# Altium schematic sheet tb6612fng.SchDoc
size A4
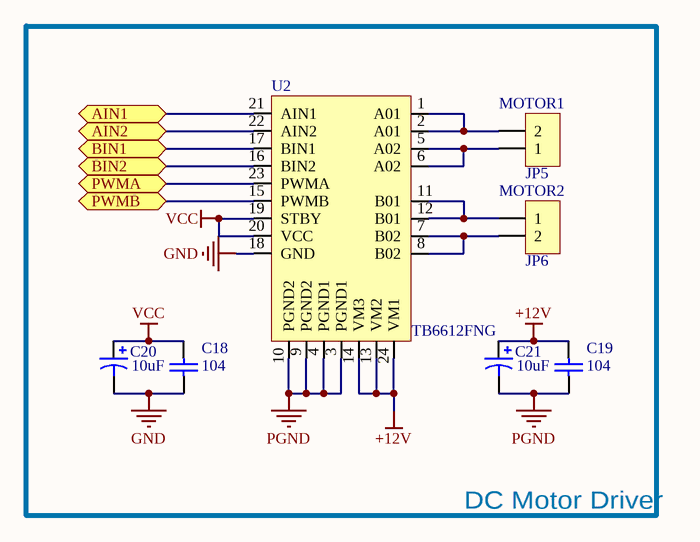
[diagram p0: tb6612fng.SchDoc]

## Parts
C18  104  [C 0603_L]
C19  104  [C 0603_L]
C20  10uF  [CD A(3216)]
C21  10uF  [CD A(3216)]
JP5  MOTOR1  [XH2.54-LI-2P]
JP6  MOTOR2  [XH2.54-LI-2P]
U2  TB6612FNG  [SSOP24_N]

## Blocks framed on the sheet
DC Motor Driver: C18-C21 JP5 JP6 U2

## Ports
AIN1 (bidir), AIN2 (bidir), BIN1 (bidir), BIN2 (bidir), PWMA (bidir), PWMB (bidir)

## Nets
+12V: C19.2 C21.1 U2.13(VM2) U2.14(VM3) U2.24(VM1)
GND: C18.1 C20.2 U2.18(GND)
PGND: C19.1 C21.2 U2.3(PGND1) U2.4(PGND1) U2.9(PGND2) U2.10(PGND2)
VCC: C18.2 C20.1 U2.19(STBY) U2.20(VCC)
AIN1: U2.21(AIN1) ; port AIN1
AIN2: U2.22(AIN2) ; port AIN2
BIN1: U2.17(BIN1) ; port BIN1
BIN2: U2.16(BIN2) ; port BIN2
PWMA: U2.23(PWMA) ; port PWMA
PWMB: U2.15(PWMB) ; port PWMB
NetJP5_1: JP5.1 U2.5(A02) U2.6(A02)
NetJP5_2: JP5.2 U2.1(A01) U2.2(A01)
NetJP6_1: JP6.1 U2.11(B01) U2.12(B01)
NetJP6_2: JP6.2 U2.7(B02) U2.8(B02)

## Library data of the parts
C18 C19 = Cap: Capacitor; Published: 8-Jun-2000; LatestRevisionDate: 17-Jul-2002; LatestRevisionNote: Re-released for DXP Platform.; PackageReference: RAD-0.3; Publisher: Altium Limited; PackageDescription: Radial Cap, Thru-Hole; 2 Leads; 0.3 in Pin Spacing; Value: 104
C20 C21 = Cap Pol1: Polarized Capacitor (Radial); Published: 8-Jun-2000; LatestRevisionDate: 17-Jul-2002; LatestRevisionNote: Re-released for DXP Platform.; PackageReference: RB7.6-15; Publisher: Altium Limited; PackageDescription: Polarized Capacitor (Radial); 2 Leads; Value: 10uF
JP5 JP6 = Header 2: 2P接插件; 版权归属: 源创客; BOM名称: 2P接插件; 学习资源: www.ooocke.com
U2 = TB6612FNG: DC_MOTOR_DRIVER